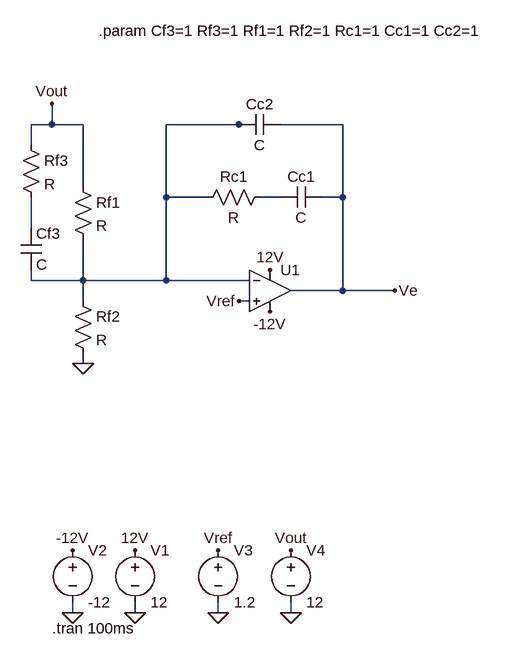
[diagram p0: schematic type_III_model.asc]
type_III_model.asc, the LTspice schematic file:
Version 4
SHEET 1 880 680
WIRE -192 -304 -192 -336
WIRE -192 -304 -224 -304
WIRE -144 -304 -192 -304
WIRE 96 -304 -16 -304
WIRE 112 -304 96 -304
WIRE 256 -304 160 -304
WIRE -224 -272 -224 -304
WIRE -144 -208 -144 -304
WIRE -16 -192 -16 -304
WIRE 48 -192 -16 -192
WIRE 160 -192 128 -192
WIRE 256 -192 256 -304
WIRE 256 -192 224 -192
WIRE -224 -144 -224 -192
WIRE -224 -64 -224 -80
WIRE -144 -64 -144 -128
WIRE -144 -64 -224 -64
WIRE -16 -64 -16 -192
WIRE -16 -64 -144 -64
WIRE 112 -64 -16 -64
WIRE 256 -48 256 -192
WIRE 256 -48 176 -48
WIRE 336 -48 256 -48
WIRE -144 -32 -144 -64
WIRE 112 -32 96 -32
WIRE -144 64 -144 48
WIRE -160 448 -160 432
WIRE -64 448 -64 432
WIRE 64 448 64 432
WIRE 176 448 176 432
FLAG -64 448 0
FLAG -160 448 0
FLAG -64 352 12V
FLAG -160 352 -12V
FLAG 144 -16 -12V
FLAG 144 -80 12V
FLAG 64 448 0
FLAG 64 352 Vref
FLAG 96 -32 Vref
FLAG -144 64 0
FLAG 176 448 0
FLAG 176 352 Vout
FLAG -192 -336 Vout
FLAG 336 -48 Ve
SYMBOL voltage -64 336 R0
WINDOW 123 0 0 Left 0
WINDOW 39 0 0 Left 0
SYMATTR InstName V1
SYMATTR Value 12
SYMBOL voltage -160 336 R0
WINDOW 123 0 0 Left 0
WINDOW 39 0 0 Left 0
SYMATTR InstName V2
SYMATTR Value -12
SYMBOL OpAmps\\UniversalOpAmp2 144 -48 R0
SYMATTR InstName U1
SYMBOL res 144 -208 R90
WINDOW 0 0 56 VBottom 2
WINDOW 3 32 56 VTop 2
SYMATTR InstName Rc1
SYMBOL cap 224 -208 R90
WINDOW 0 0 32 VBottom 2
WINDOW 3 32 32 VTop 2
SYMATTR InstName Cc1
SYMBOL cap 160 -320 R90
WINDOW 0 0 32 VBottom 2
WINDOW 3 32 32 VTop 2
SYMATTR InstName Cc2
SYMBOL voltage 64 336 R0
WINDOW 123 0 0 Left 0
WINDOW 39 0 0 Left 0
SYMATTR InstName V3
SYMATTR Value 1.2
SYMBOL res -160 -48 R0
SYMATTR InstName Rf2
SYMBOL cap -240 -144 R0
SYMATTR InstName Cf3
SYMBOL res -240 -288 R0
SYMATTR InstName Rf3
SYMBOL res -160 -224 R0
SYMATTR InstName Rf1
SYMBOL voltage 176 336 R0
WINDOW 123 0 0 Left 0
WINDOW 39 0 0 Left 0
SYMATTR InstName V4
SYMATTR Value 12
TEXT -192 472 Left 2 !.tran 100ms
TEXT -120 -448 Left 2 !.param Cf3=1 Rf3=1 Rf1=1 Rf2=1 Rc1=1 Cc1=1 Cc2=1

The netlist it stands for:
* type_III_model.asc
V1 12V 0 12
V2 -12V 0 -12
XU1 Vref N001 12V -12V Ve level2 Avol=1Meg GBW=10Meg Slew=10Meg Ilimit=25m Rail=0 Vos=0 En=0 Enk=0 In=0 Ink=0 Rin=500Meg  ; pins In+ In- V+ V- OUT
Rc1 N002 N001 R
Cc1 Ve N002 C
Cc2 Ve N001 C
V3 Vref 0 1.2
Rf2 N001 0 R
Cf3 N003 N001 C
Rf3 Vout N003 R
Rf1 Vout N001 R
V4 Vout 0 12
.tran 100ms
.param Cf3=1 Rf3=1 Rf1=1 Rf2=1 Rc1=1 Cc1=1 Cc2=1
.lib UniversalOpAmp2.lib
.backanno
.end